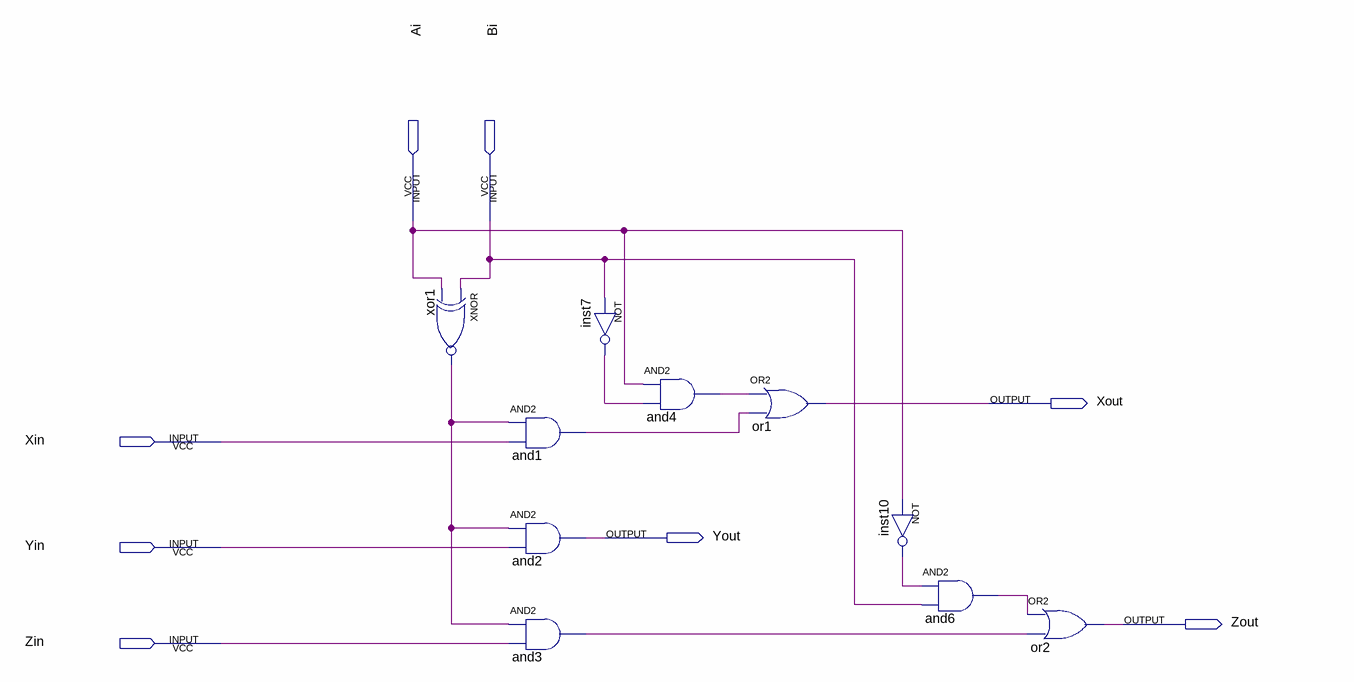
[diagram p0: schematic sheet]
// Quartus schematic Cmp1Bit.bdf as structural Verilog: 10 symbols, 8 pins
module Cmp1Bit (
  input  Ai,
  input  Bi,
  input  Xin,
  input  Yin,
  input  Zin,
  output Xout,
  output Yout,
  output Zout
);

  wire and1_out, and3_out, and4_out, and6_out, inst7_out, inst10_out, xor1_out;

  xnor xor1 (xor1_out, Bi, Ai);
  and and1 (and1_out, xor1_out, Xin);
  and and2 (Yout, xor1_out, Yin);
  and and3 (and3_out, xor1_out, Zin);
  not inst7 (inst7_out, Bi);
  and and4 (and4_out, Ai, inst7_out);
  or or1 (Xout, and4_out, and1_out);
  not inst10 (inst10_out, Ai);
  and and6 (and6_out, inst10_out, Bi);
  or or2 (Zout, and6_out, and3_out);
endmodule
